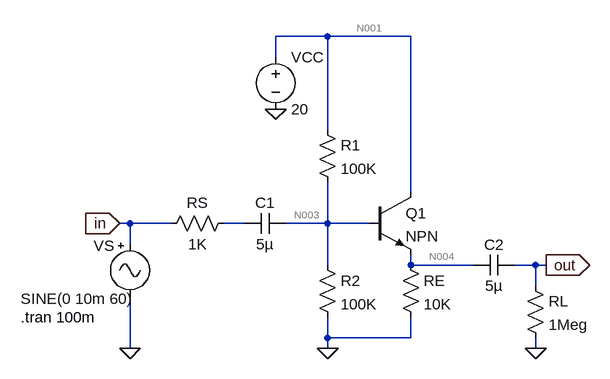
[diagram p0: schematic bjt_cc_follower.asc]
bjt_cc_follower.asc, the LTspice schematic file:
Version 4.1
SHEET 1 880 680
WIRE 400 -224 320 -224
WIRE 528 -224 400 -224
WIRE 320 -192 320 -224
WIRE 400 -80 400 -224
WIRE 528 16 528 -224
WIRE 96 64 80 64
WIRE 160 64 96 64
WIRE 272 64 240 64
WIRE 400 64 400 0
WIRE 400 64 336 64
WIRE 464 64 400 64
WIRE 96 96 96 64
WIRE 400 128 400 64
WIRE 528 128 528 112
WIRE 624 128 528 128
WIRE 720 128 688 128
WIRE 736 128 720 128
WIRE 720 160 720 128
WIRE 400 240 400 208
WIRE 528 240 528 208
WIRE 528 240 400 240
WIRE 96 256 96 176
WIRE 400 256 400 240
WIRE 720 256 720 240
FLAG 320 -112 0
FLAG 400 256 0
FLAG 720 256 0
FLAG 96 256 0
FLAG 736 128 out
IOPIN 736 128 Out
FLAG 80 64 in
IOPIN 80 64 In
SYMBOL Misc\\signal 96 80 R0
WINDOW 0 -56 18 Left 2
WINDOW 3 -168 100 Left 2
SYMATTR InstName VS
SYMATTR Value SINE(0 10m 60)
SYMBOL res 256 48 R90
WINDOW 0 0 56 VBottom 2
WINDOW 3 32 56 VTop 2
SYMATTR InstName RS
SYMATTR Value 1K
SYMBOL cap 336 48 R90
WINDOW 0 0 32 VBottom 2
WINDOW 3 32 32 VTop 2
SYMATTR InstName C1
SYMATTR Value 5µ
SYMBOL voltage 320 -208 R0
SYMATTR InstName VCC
SYMATTR Value 20
SYMBOL npn 464 16 R0
SYMATTR InstName Q1
SYMBOL res 512 112 R0
SYMATTR InstName RE
SYMATTR Value 10K
SYMBOL res 384 112 R0
SYMATTR InstName R2
SYMATTR Value 100K
SYMBOL res 384 -96 R0
SYMATTR InstName R1
SYMATTR Value 100K
SYMBOL cap 688 112 R90
WINDOW 0 0 32 VBottom 2
WINDOW 3 32 32 VTop 2
SYMATTR InstName C2
SYMATTR Value 5µ
SYMBOL res 704 144 R0
SYMATTR InstName RL
SYMATTR Value 1Meg
TEXT -72 208 Left 2 !.tran 100m

The netlist it stands for:
* bjt_cc_follower.asc
VS in 0 SINE(0 10m 60)
RS N002 in 1K
C1 N003 N002 5µ
VCC N001 0 20
Q1 N001 N003 N004 0 NPN
RE N004 0 10K
R2 N003 0 100K
R1 N001 N003 100K
C2 out N004 5µ
RL out 0 1Meg
.model NPN NPN
.model PNP PNP
.lib standard.bjt
.tran 100m
.backanno
.end

* Results of the author's LTspice run, read from the files saved beside the schematic
* Operating Point, zero values left out:
*   V(n001) = 20 V
*   V(n003) = 9.565 V
*   V(n004) = 8.794 V
*   I(R1) = 104.4 µA
*   I(R2) = 95.65 µA
*   I(RE) = 879.4 µA
*   I(VCC) = -975 µA
*   Ib(Q1) = 8.707 µA
*   Ic(Q1) = 870.7 µA
*   Ie(Q1) = -879.4 µA
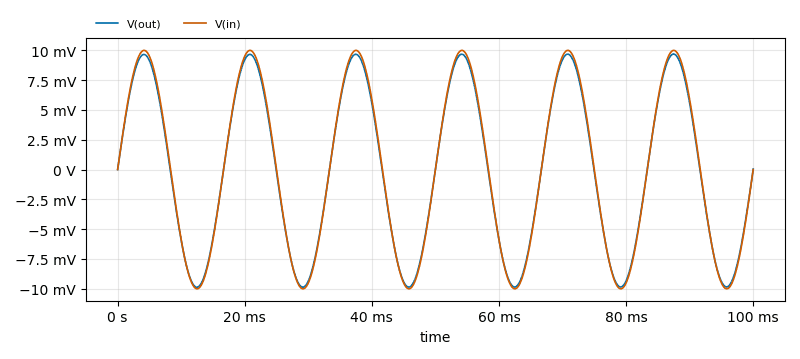
[diagram p1: Transient Analysis of bjt_cc_follower.asc, plotted from the saved traces]
* Transient Analysis, 1 run:
*   V(out): min -9.87 mV, max 9.686 mV, average -91.52 µV, rms 6.904 mV, last 37.75 µV
*   V(in): min -10 mV, max 10 mV, average 0 V, rms 7.071 mV, last 0 V